# EAGLE schematic Stratologger sl100 Board (EAGLE 8.7.1)
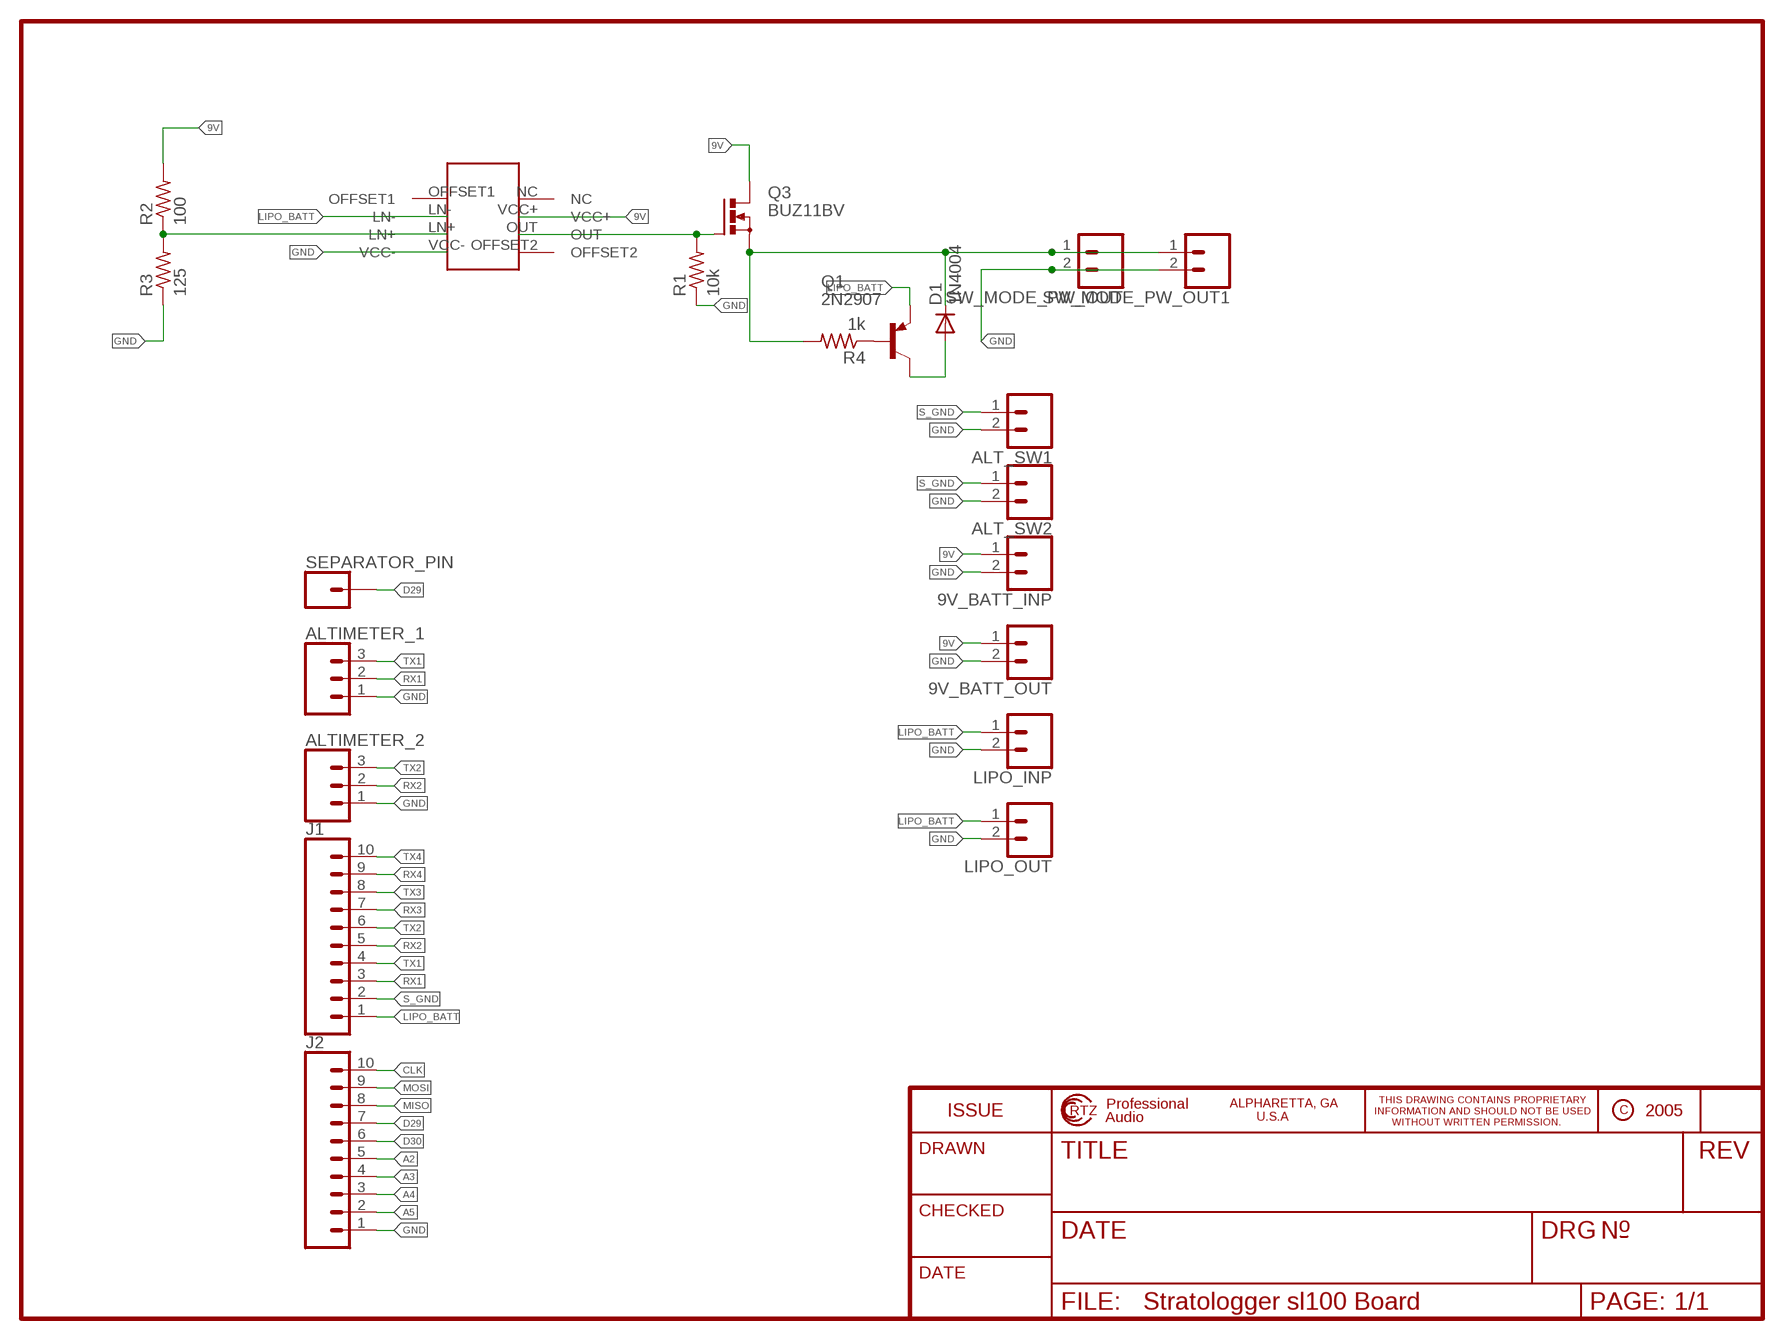
[diagram p0: schematic, sheet 1]

## Parts
9V_BATT_INP  CONN_02  [1X02]
9V_BATT_OUT  CONN_02  [1X02]
ALT_SW1  CONN_02  [1X02]
ALT_SW2  CONN_02  [1X02]
ALTIMETER_1  CONN_03  [1X03]
ALTIMETER_2  CONN_03  [1X03]
D1  1N4004  [DO41-10]
J1  CONN_10"  [1X10]
J2  CONN_10"  [1X10]
LIPO_INP  CONN_02  [1X02]
LIPO_OUT  CONN_02  [1X02]
Q1  2N2907  [TO92-EBC-OVAL]
Q3  BUZ11BV  [TO220BV]
R1  10k  R-US_0207/12  [0207/12]
R2  100  R-US_0207/12  [0207/12]
R3  125  R-US_0207/12  [0207/12]
R4  1k  R-US_0207/12  [0207/12]
SEPARATOR_PIN  CONN_01  [1X01]
SW_MODE_PW_OUT  CONN_02  [1X02]
SW_MODE_PW_OUT1  CONN_02  [1X02]
U$2  STRATOLOGGER  [STRATOLOGGER]
U$3  LM471  [LM741]
U$4  STRATOLOGGER  [STRATOLOGGER]

## Nets
5V_DIV: R2.1 R3.2 U$3.LN+
9V: 9V_BATT_INP.1 9V_BATT_OUT.1 Q3.D R2.2 U$3.VCC+
A2: J2.5
A3: J2.4
A4: J2.3
A5: J2.2
CLK: J2.10
D29: J2.7 SEPARATOR_PIN.1
D30: J2.6
GND: 9V_BATT_INP.2 9V_BATT_OUT.2 ALT_SW1.2 ALT_SW2.2 ALTIMETER_1.1 ALTIMETER_2.1 J2.1 LIPO_INP.2 LIPO_OUT.2 R1.1 R3.1 SW_MODE_PW_OUT1.2 SW_MODE_PW_OUT.2 U$3.VCC-
LIPO_BATT: J1.1 LIPO_INP.1 LIPO_OUT.1 Q1.E U$3.LN-
MISO: J2.8
MOSI: J2.9
N$1: Q1.B R4.1
N$2: D1.A Q1.C
N$5: Q3.G R1.2 U$3.OUT
N$7: D1.C Q3.S R4.2 SW_MODE_PW_OUT1.1 SW_MODE_PW_OUT.1
RX1: ALTIMETER_1.2 J1.3
RX2: ALTIMETER_2.2 J1.5
RX3: J1.7
RX4: J1.9
S_GND: ALT_SW1.1 ALT_SW2.1 J1.2
TX1: ALTIMETER_1.3 J1.4
TX2: ALTIMETER_2.3 J1.6
TX3: J1.8
TX4: J1.10
Unconnected: U$3.NC U$3.OFFSET1 U$3.OFFSET2

## Library data of the parts
9V_BATT_INP 9V_BATT_OUT ALT_SW1 ALT_SW2 LIPO_INP LIPO_OUT SW_MODE_PW_OUT SW_MODE_PW_OUT1 = SparkFun-Connectors:CONN_02: Multi connection point. Often used as Generic Header-pin footprint for 0.1 inch spaced/style header connections On any of the 0.1 inch spaced packages, you can populate with these: Break Away Headers - Straight <https://www.sparkfun.com/products/116> (PRT-00116) Break Away Male Headers - Right Angle <https://www.sparkfun.com/products/553> (PRT-00553) Female Headers <https://www.sparkfun.com/products/115> (PRT-00115) Break Away Headers - Machine Pin <https://www.sparkfun.com/products/117> (PRT-00117) Break Away Female Headers - Swiss Machine Pin <https://www.sparkfun.com/products/743> (PRT-00743) For SCREWTERMINALS and SPRING TERMINALS visit here: Screw Terimnals on SparkFun.com <https://www.sparkfun.com/search/results?term=Screw+Terminals> (5mm/3.5mm/2.54mm spacing) This device is also useful as a general connection point to wire up your design to another part of your project. Our various solder wires solder well into these plated through hole pads. Hook-Up Wire - Assortment (Stranded, 22 AWG) <https://www.sparkfun.com/products/11375> (PRT-11375) Hook-Up Wire - Assortment (Solid Core, 22 AWG) <https://www.sparkfun.com/products/11367> (PRT-11367) View the entire wire category on our website here <https://www.sparkfun.com/categories/141> Special notes: Molex polarized connector foot print use with: PRT-08233 with associated crimp pins and housings. 2.54_SCREWTERM for use with PRT-10571. 3.5mm Screw Terminal footprints for PRT-08084 5mm Screw Terminal footprints for use with PRT-08432
ALTIMETER_1 ALTIMETER_2 = SparkFun-Connectors:CONN_03: Multi connection point. Often used as Generic Header-pin footprint for 0.1 inch spaced/style header connections On any of the 0.1 inch spaced packages, you can populate with these: Break Away Headers - Straight <https://www.sparkfun.com/products/116> (PRT-00116) Break Away Male Headers - Right Angle <https://www.sparkfun.com/products/553> (PRT-00553) Female Headers <https://www.sparkfun.com/products/115> (PRT-00115) Break Away Headers - Machine Pin <https://www.sparkfun.com/products/117> (PRT-00117) Break Away Female Headers - Swiss Machine Pin <https://www.sparkfun.com/products/743> (PRT-00743) Stackable Header - 3 Pin (Female, 0.1") <https://www.sparkfun.com/products/13875> (PRT-13875) For SCREWTERMINALS and SPRING TERMINALS visit here: Screw Terimnals on SparkFun.com <https://www.sparkfun.com/search/results?term=Screw+Terminals> (5mm/3.5mm/2.54mm spacing) This device is also useful as a general connection point to wire up your design to another part of your project. Our various solder wires solder well into these plated through hole pads. Hook-Up Wire - Assortment (Stranded, 22 AWG) <https://www.sparkfun.com/products/11375> (PRT-11375) Hook-Up Wire - Assortment (Solid Core, 22 AWG) <https://www.sparkfun.com/products/11367> (PRT-11367) View the entire wire category on our website here <https://www.sparkfun.com/categories/141> Special notes: Molex polarized connector foot print use with SKU : PRT-08232 with associated crimp pins and housings.
D1 = adafruit:1N4004: DIODE General purpose 1N400x type rectifier (With bigger pads) http://www.ladyada.net/library/pcb/eaglelibrary.html
J1 J2 = SparkFun-Connectors:CONN_10: Multi connection point. Often used as Generic Header-pin footprint for 0.1 inch spaced/style header connections On any of the 0.1 inch spaced packages, you can populate with these: Break Away Headers - Straight <https://www.sparkfun.com/products/116> (PRT-00116) Break Away Male Headers - Right Angle <https://www.sparkfun.com/products/553> (PRT-00553) Female Headers <https://www.sparkfun.com/products/115> (PRT-00115) Break Away Headers - Machine Pin <https://www.sparkfun.com/products/117> (PRT-00117) Break Away Female Headers - Swiss Machine Pin <https://www.sparkfun.com/products/743> (PRT-00743) Arduino Stackable Header - 10 Pin <https://www.sparkfun.com/products/11376> (PRT-11376) For SCREWTERMINALS and SPRING TERMINALS visit here: Screw Terimnals on SparkFun.com <https://www.sparkfun.com/search/results?term=Screw+Terminals> (5mm/3.5mm/2.54mm spacing) This device is also useful as a general connection point to wire up your design to another part of your project. Our various solder wires solder well into these plated through hole pads. Hook-Up Wire - Assortment (Stranded, 22 AWG) <https://www.sparkfun.com/products/11375> (PRT-11375) Hook-Up Wire - Assortment (Solid Core, 22 AWG) <https://www.sparkfun.com/products/11367> (PRT-11367) View the entire wire category on our website here <https://www.sparkfun.com/categories/141> Special notes: Molex polarized connector foot print use with SKU : PRT-08231 with associated crimp pins and housings. 1MM SMD Version SKU: PRT-10208 NOTES ON THE VARIANTS LOCK and LOCK_LONGPADS... This footprint was designed to help hold the alignment of a through-hole component (i.e. 6-pin header) while soldering it into place. You may notice that each hole has been shifted either up or down by 0.005 of an inch from it's more standard position (which is a perfectly straight line). This slight alteration caused the pins (the squares in the middle) to touch the edges of the holes. Because they are alternating, it causes a "brace" to hold the component in place. 0.005 has proven to be the perfect amount of "off-center" position when using our standard breakaway headers. Although looks a little odd when you look at the bare footprint, once you have a header in there, the alteration is very hard to notice. Also,if you push a header all the way into place, it is covered up entirely on the bottom side.; PROD_ID: CONN-11563
Q1 = adafruit:2N2907*: PNP Transistor Big Oval pads
Q3 = transistor-power:BUZ11: N-CHANNEL MOS FET
R1-R4 = adafruit:R-US_: RESISTOR, American symbol
SEPARATOR_PIN = SparkFun-Connectors:CONN_01: Single connection point. Often used as Generic Header-pin footprint for 0.1 inch spaced/style header connections On any of the 0.1 inch spaced packages, you can populate with these: Break Away Headers - Straight <https://www.sparkfun.com/products/116> (PRT-00116) Break Away Male Headers - Right Angle <https://www.sparkfun.com/products/553> (PRT-00553) Female Headers <https://www.sparkfun.com/products/115> (PRT-00115) Break Away Headers - Machine Pin <https://www.sparkfun.com/products/117> (PRT-00117) Break Away Female Headers - Swiss Machine Pin <https://www.sparkfun.com/products/743> (PRT-00743) This device is also useful as a general connection point to wire up your design to another part of your project. Our various solder wires solder well into these plated through hole pads. Hook-Up Wire - Assortment (Stranded, 22 AWG) <https://www.sparkfun.com/products/11375> (PRT-11375) Hook-Up Wire - Assortment (Solid Core, 22 AWG) <https://www.sparkfun.com/products/11367> (PRT-11367) View the entire wire category on our website here <https://www.sparkfun.com/categories/141> Special notes: SMTSO-256-ET is a "flush mount" nut for a 4-40 screw. We mostly use this on specialty testbeds; it is a nice way to connect hardware to your PCB at an adjustable hieght. Also note, the SNAP packages are for using a snappable style connector. We sell a baggie of snaps and they are also used on two LilyPad designs: Snap Assortment - 30 pack (male and female) <https://www.sparkfun.com/products/11347> (DEV-11347) LilyPad Arduino SimpleSnap <https://www.sparkfun.com/products/10941> (DEV-10941) LilyPad SimpleSnap Protoboard <https://www.sparkfun.com/products/10940> (DEV-10940)
U$2 U$4 = LRA_FlightCPU_Components:STRATOLOGGER
U$3 = LM741:LM471